# Altium schematic sheet STM32_microcontroller_IOs.SchDoc: STM32_microcontroller_IOs
size A3; Date: Not used; ApprovedBy: Not used; CheckedBy: Not used; Author: Not used; CompanyName: STMicroelectronics; DrawnBy: Not used; Engineer: Not used; Organization: Not used; Address1: Not used; Address2: Not used; Address3: Not used; Address4: Not used; DocumentNumber: Not used; Revision: Not used; SheetNumber: 3; SheetTotal: 12; CurrentTime: Not used; CurrentDate: Not used; Time: Not used; DocumentFullPathAndName: Not used; DocumentName: Not used; ModifiedDate: Not used; ImagePath: Not used; ProjectName: Not used; Application_BuildNumber: Not used
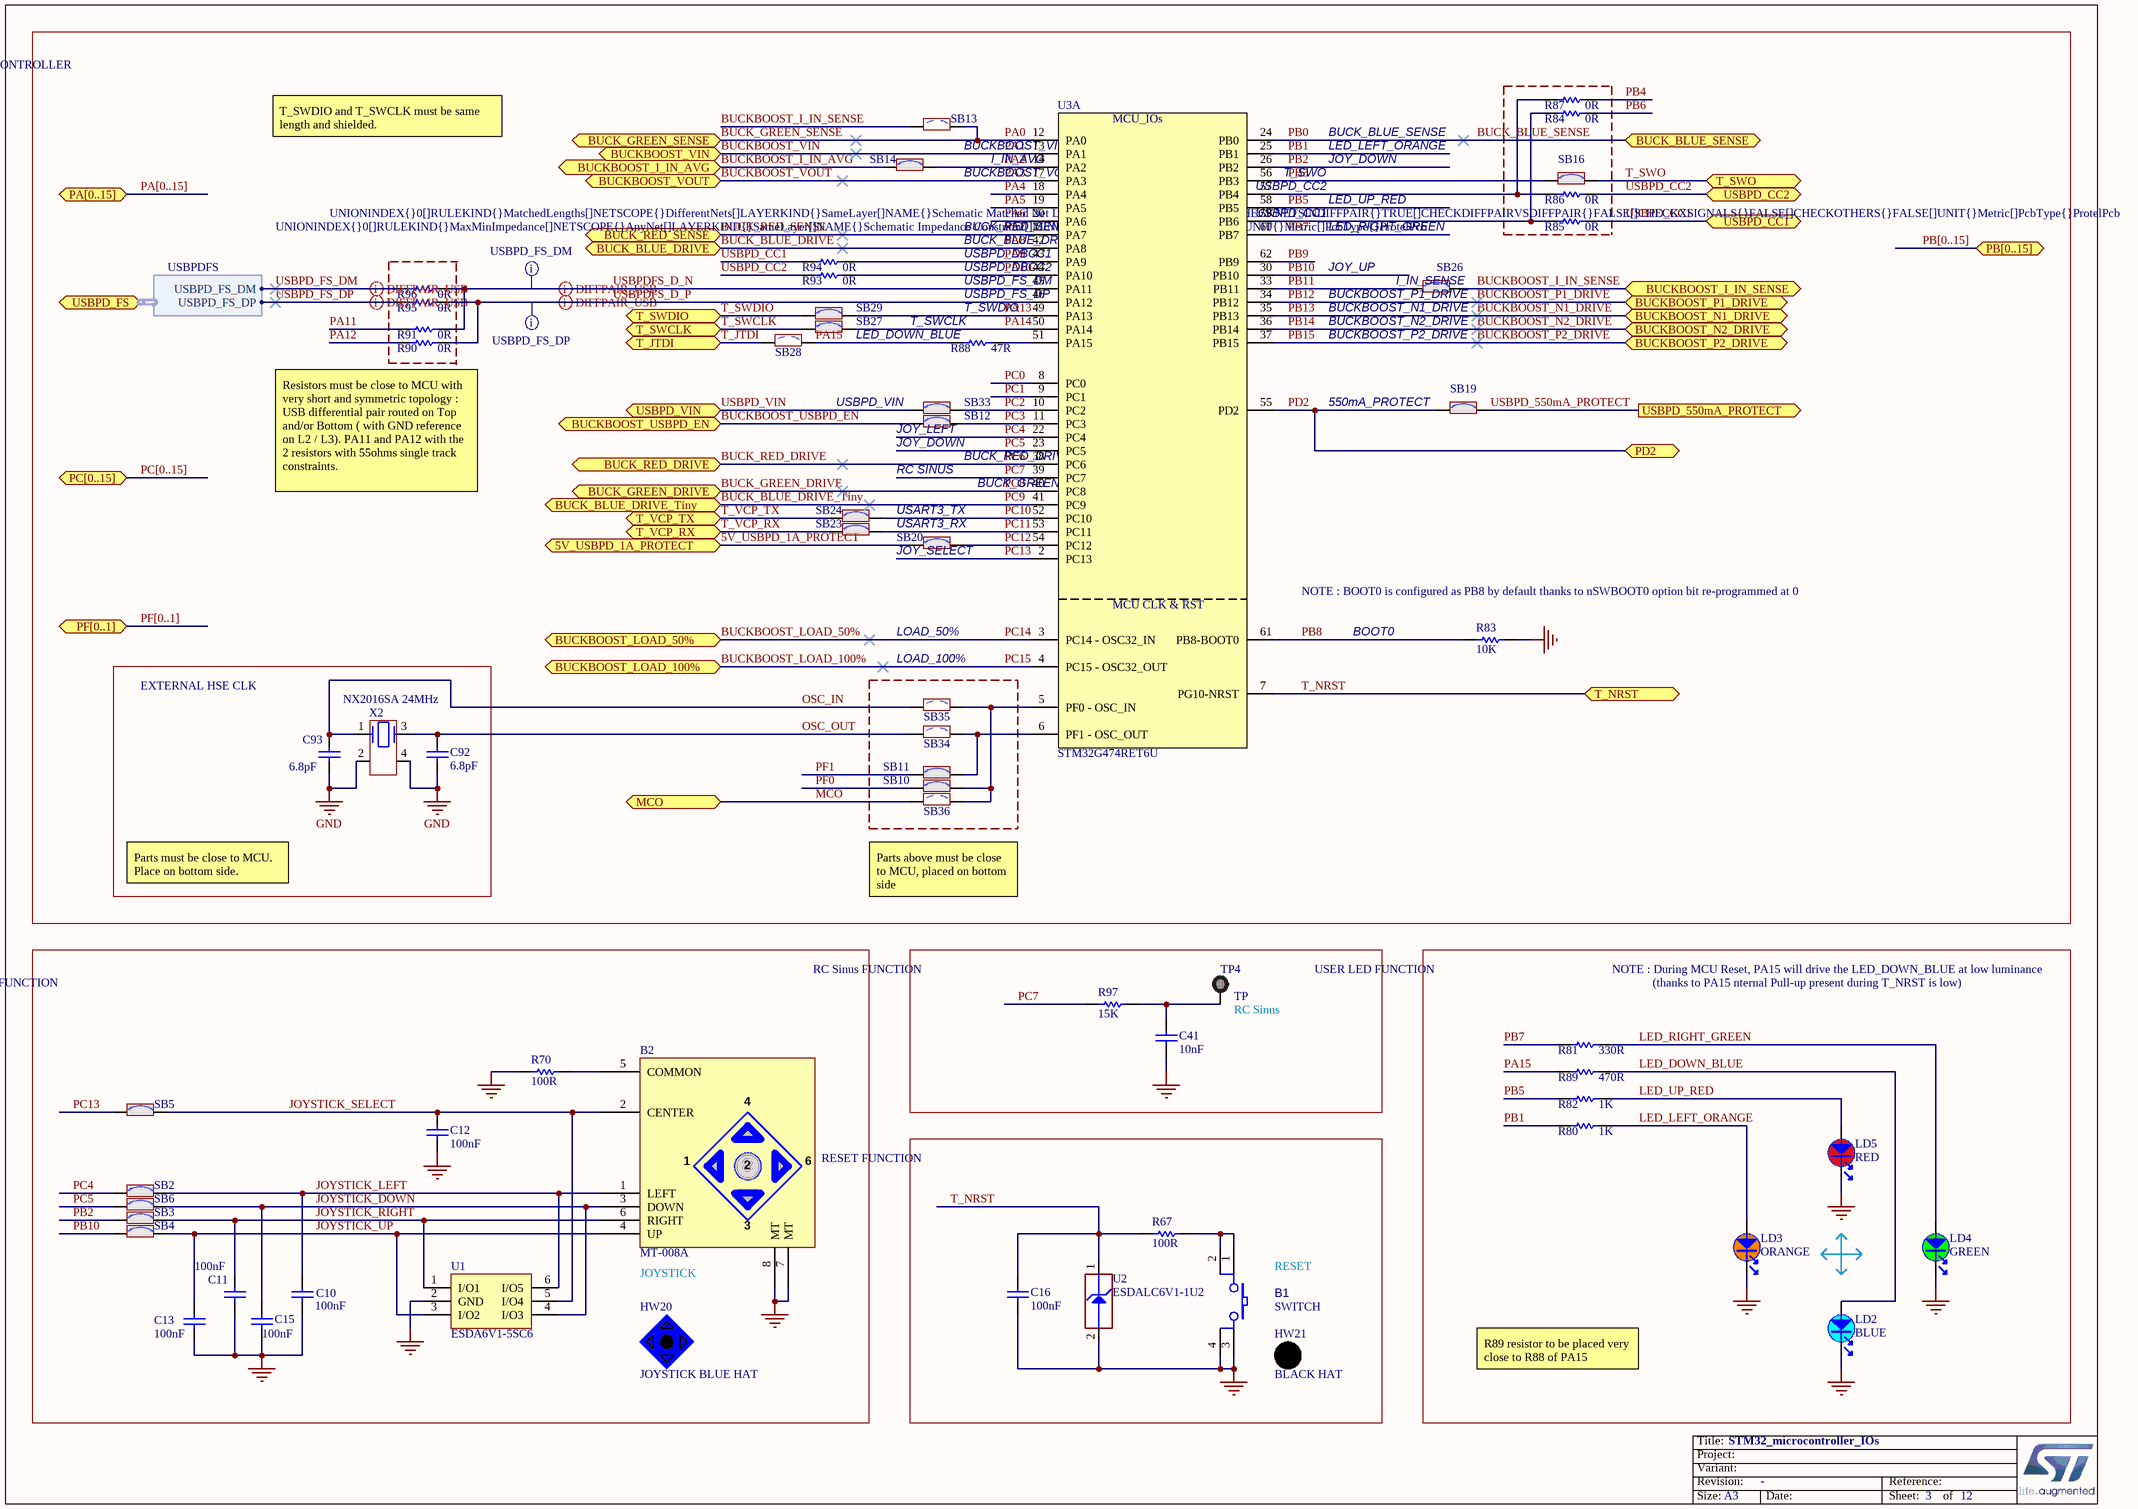
[diagram p0: STM32_microcontroller_IOs.SchDoc]

## Parts
B1  value SWITCH  [SWI_WEALTHMETAL_TD-0341_4P_BLACK]
B2  value MT-008A  [SWI_XIEJIA_MT-008A_6P]
C10  value 100nF  [C0402]
C11  value 100nF  [C0402]
C12  value 100nF  [C0402]
C13  value 100nF  [C0402]
C15  value 100nF  [C0402]
C16  value 100nF  [C0402]
C41  value 10nF  [C0603]
C92  value 6.8pF  [C0402]
C93  value 6.8pF  [C0402]
HW20  value JOYSTICK BLUE HAT  (hidden comment: JOYSTICK_BLUE_HAT)  (mechanical)
HW21  value BLACK HAT  (mechanical)
LD2  value BLUE  [LED_0603_SMD-B_BLUE_H0P4]
LD3  value ORANGE  [LED_0603_ORANGE_H0P4]
LD4  value GREEN  [LED_0603_GREEN]
LD5  value RED  [LED_0603_RED]
R67  value 100R  [R0603]
R70  value 100R  [R0603]
R80  value 1K  [R0603]
R81  value 330R  [R0603]
R82  value 1K  [R0603]
R83  value 10K  [R0603]
R84  value 0R  [R0402]
R85  value 0R  [R0402]
R86  value 0R  [R0402]
R87  value 0R  [R0402]
R88  value 47R  [R0402]
R89  value 470R  [R0603]
R90  value 0R  [R0402]
R91  value 0R  [R0402]
R93  value 0R  [R0402]
R94  value 0R  [R0402]
R95  value 0R  [R0402]
R96  value 0R  [R0402]
R97  value 15K  [R0603]
SB2  (no value)  [SOLDER-BRIDGE_R0603-0R]
SB3  (no value)  [SOLDER-BRIDGE_R0603-0R]
SB4  (no value)  [SOLDER-BRIDGE_R0603-0R]
SB5  (no value)  [SOLDER-BRIDGE_R0603-0R]
SB6  (no value)  [SOLDER-BRIDGE_R0603-0R]
SB10  (no value)  [SOLDER-BRIDGE_R0603-0R]
SB11  (no value)  [SOLDER-BRIDGE_R0603-0R]
SB12  (no value)  [SOLDER-BRIDGE_R0603-0R]
SB13  (no value)  [SOLDER-BRIDGE_R0603-0R]
SB14  (no value)  [SOLDER-BRIDGE_R0603-0R]
SB16  (no value)  [SOLDER-BRIDGE_R0603-0R]
SB19  (no value)  [SOLDER-BRIDGE_R0603-0R]
SB20  (no value)  [SOLDER-BRIDGE_R0603-0R]
SB23  (no value)  [SOLDER-BRIDGE_R0603-0R]
SB24  (no value)  [SOLDER-BRIDGE_R0603-0R]
SB26  (no value)  [SOLDER-BRIDGE_R0603-0R]
SB27  (no value)  [SOLDER-BRIDGE_R0603-0R]
SB28  (no value)  [SOLDER-BRIDGE_R0603-0R]
SB29  (no value)  [SOLDER-BRIDGE_R0603-0R]
SB33  (no value)  [SOLDER-BRIDGE_R0603-0R]
SB34  (no value)  [SOLDER-BRIDGE_R0603-0R]
SB35  (no value)  [SOLDER-BRIDGE_R0603-0R]
SB36  (no value)  [SOLDER-BRIDGE_R0603-0R]
TP4  value TP  [TP_PTH_1MM_2MM]
U1  value ESDA6V1-5SC6  [ESD_SOT23-6L]
U2  value ESDALC6V1-1U2  [ESD_ST0201]
U3  STM32G474RET6U  [ICC_LQFP64_10X10_P050]  (part A of 2)
X2  value NX2016SA 24MHz  [CRY_NX2016SA_4P]

## Blocks framed on the sheet
EXTERNAL HSE CLK: C92 C93 X2
LOAD_100%: SB10 SB11 SB34-SB36
USER LED FUNCTION: LD2-LD5 R80-R82 R89

## Ports
5V_USBPD_1A_PROTECT, BUCK_BLUE_DRIVE, BUCK_BLUE_DRIVE_Tiny, BUCK_BLUE_SENSE, BUCK_GREEN_DRIVE, BUCK_GREEN_SENSE, BUCK_RED_DRIVE, BUCK_RED_SENSE, BUCKBOOST_I_IN_AVG, BUCKBOOST_I_IN_SENSE, BUCKBOOST_LOAD_50%, BUCKBOOST_LOAD_100%, BUCKBOOST_N1_DRIVE, BUCKBOOST_N2_DRIVE, BUCKBOOST_P1_DRIVE, BUCKBOOST_P2_DRIVE, BUCKBOOST_USBPD_EN, BUCKBOOST_VIN, BUCKBOOST_VOUT, MCO, PA[0..15] (bidir), PB[0..15] (bidir), PC[0..15] (bidir), PD2, PF[0..1] (bidir), T_JTDI, T_NRST, T_SWCLK, T_SWDIO, T_SWO, T_VCP_RX, T_VCP_TX, USBPD_550mA_PROTECT, USBPD_CC1, USBPD_CC2, USBPD_FS (harness USBPDFS), USBPD_VIN

## Harnesses
USBPDFS: USBPD_FS_DM, USBPD_FS_DP

## Nets
GND: B1.3 B1.4 B2.7(MT) B2.8(MT) C10.1 C11.1 C12.1 C13.1 C15.1 C16.1 C41.1 C92.1 C93.1 LD2.2 LD3.2 LD4.2 LD5.2 R70.1 R83.1 U1.2(GND) U2.2(GND) X2.2 X2.4
5V_USBPD_1A_PROTECT: SB20.1 ; port 5V_USBPD_1A_PROTECT
BUCK_BLUE_DRIVE: U3.42(PA8) ; port BUCK_BLUE_DRIVE  [also labelled PA8]
BUCK_BLUE_DRIVE_Tiny: U3.41(PC9) ; port BUCK_BLUE_DRIVE_Tiny  [also labelled PC9]
BUCK_BLUE_SENSE: U3.24(PB0) ; port BUCK_BLUE_SENSE  [also labelled PB0]
BUCK_GREEN_DRIVE: U3.40(PC8) ; port BUCK_GREEN_DRIVE  [also labelled PC8]
BUCK_GREEN_SENSE: SB13.2 U3.12(PA0) ; port BUCK_GREEN_SENSE  [also labelled PA0]
BUCK_RED_DRIVE: U3.38(PC6) ; port BUCK_RED_DRIVE  [also labelled PC6]
BUCK_RED_SENSE: U3.21(PA7) ; port BUCK_RED_SENSE  [also labelled PA7]
BUCKBOOST_I_IN_AVG: SB14.1 ; port BUCKBOOST_I_IN_AVG
BUCKBOOST_I_IN_SENSE: SB13.1 SB26.2 ; port BUCKBOOST_I_IN_SENSE
BUCKBOOST_LOAD_50%: U3.3(PC14_-_OSC32_IN) ; port BUCKBOOST_LOAD_50%  [also labelled PC14]
BUCKBOOST_LOAD_100%: U3.4(PC15_-_OSC32_OUT) ; port BUCKBOOST_LOAD_100%  [also labelled PC15]
BUCKBOOST_N1_DRIVE: U3.35(PB13) ; port BUCKBOOST_N1_DRIVE  [also labelled PB13]
BUCKBOOST_N2_DRIVE: U3.36(PB14) ; port BUCKBOOST_N2_DRIVE  [also labelled PB14]
BUCKBOOST_P1_DRIVE: U3.34(PB12) ; port BUCKBOOST_P1_DRIVE  [also labelled PB12]
BUCKBOOST_P2_DRIVE: U3.37(PB15) ; port BUCKBOOST_P2_DRIVE  [also labelled PB15]
BUCKBOOST_USBPD_EN: SB12.1 ; port BUCKBOOST_USBPD_EN
BUCKBOOST_VIN: U3.13(PA1) ; port BUCKBOOST_VIN  [also labelled PA1]
BUCKBOOST_VOUT: U3.17(PA3) ; port BUCKBOOST_VOUT  [also labelled PA3]
JOYSTICK_DOWN: B2.3(DOWN) C15.2 SB6.2 U1.4(I/O3)
JOYSTICK_LEFT: B2.1(LEFT) C10.2 SB2.1 U1.6(I/O5)
JOYSTICK_RIGHT: B2.6(RIGHT) C11.2 SB3.1 U1.1(I/O1)
JOYSTICK_SELECT: B2.2(CENTER) C12.2 SB5.2 U1.5(I/O4)
JOYSTICK_UP: B2.4(UP) C13.2 SB4.1 U1.3(I/O2)
LED_DOWN_BLUE: LD2.1 R89.2
LED_LEFT_ORANGE: LD3.1 R80.1
LED_RIGHT_GREEN: LD4.1 R81.1
LED_UP_RED: LD5.1 R82.1
MCO: SB36.1 ; port MCO
OSC_IN: C93.2 SB35.1 X2.1
OSC_OUT: C92.2 SB34.1 X2.3
PA2: SB14.2 U3.14(PA2)
PA4: U3.18(PA4)
PA5: U3.19(PA5)
PA6: U3.20(PA6)
PA9: R94.2 U3.43(PA9)
PA10: R93.2 U3.44(PA10)
PA11: R91.1
PA12: R90.1
PA13: SB29.2 U3.49(PA13)
PA14: SB27.2 U3.50(PA14)
PA15: R88.1 R89.1 SB28.2
PB1: R80.2 U3.25(PB1)
PB2: SB3.2 U3.26(PB2)
PB3: SB16.1 U3.56(PB3)
PB4: R87.2
PB5: R82.2 U3.58(PB5)
PB6: R84.2
PB7: R81.2 U3.60(PB7)
PB8: R83.2 U3.61(PB8-BOOT0)
PB9: U3.62(PB9)
PB10: SB4.2 U3.30(PB10)
PB11: SB26.1 U3.33(PB11)
PC0: U3.8(PC0)
PC1: U3.9(PC1)
PC2: SB33.2 U3.10(PC2)
PC3: SB12.2 U3.11(PC3)
PC4: SB2.2 U3.22(PC4)
PC5: SB6.1 U3.23(PC5)
PC7: R97.1 U3.39(PC7)
PC10: SB24.2 U3.52(PC10)
PC11: SB23.2 U3.53(PC11)
PC12: SB20.2 U3.54(PC12)
PC13: SB5.1 U3.2(PC13)
PD2: SB19.1 U3.55(PD2) ; port PD2
PF0: SB10.1
PF1: SB11.1
T_JTDI: SB28.1 ; port T_JTDI
T_NRST: C16.2 R67.1 U2.1(IO1) U3.7(PG10-NRST) ; port T_NRST
T_SWCLK: SB27.1 ; port T_SWCLK
T_SWDIO: SB29.1 ; port T_SWDIO
T_SWO: SB16.2 ; port T_SWO
T_VCP_RX: SB23.1 ; port T_VCP_RX
T_VCP_TX: SB24.1 ; port T_VCP_TX
USBPD_550mA_PROTECT: SB19.2 ; port USBPD_550mA_PROTECT
USBPD_CC1: R85.2 R94.1 ; port USBPD_CC1
USBPD_CC2: R86.2 R93.1 ; port USBPD_CC2
USBPD_FS_DM: R96.1 ; port USBPD_FS.USBPD_FS_DM
USBPD_FS_DP: R95.1 ; port USBPD_FS.USBPD_FS_DP
USBPD_VIN: SB33.1 ; port USBPD_VIN
USBPDFS_D_N: R91.2 R96.2 U3.45(PA11)
USBPDFS_D_P: R90.2 R95.2 U3.46(PA12)
NetB1_1: B1.1 B1.2 R67.2
NetB2_5: B2.5(COMMON) R70.2
NetC41_2: C41.2 R97.2 TP4.1
NetR84_1: R84.1 R85.1 U3.59(PB6)
NetR86_1: R86.1 R87.1 U3.57(PB4)
NetR88_2: R88.2 U3.51(PA15)
NetSB10_2: SB10.2 SB35.2 SB36.2 U3.5(PF0_-_OSC_IN)
NetSB11_2: SB11.2 SB34.2 U3.6(PF1_-_OSC_OUT)

## Buses and harness runs
bus PA[0..15] = port PA[0..15]
bus PB[0..15] = port PB[0..15]
bus PC[0..15] = port PC[0..15]
bus PF[0..1] = port PF[0..1]

## Layout directives
differential pair; rule Impedance Constraint [Min = 85.00    Max = 95.00    ]: USBPD_FS_DM, USBPD_FS_DP, USBPDFS_D_N, USBPDFS_D_P
rule Undefined; rule Matched Net Lengths [Tolerance = 0.2mm]; rule Impedance Constraint [Min = 85.00    Max = 95.00    ]: USBPDFS_D_N, USBPDFS_D_P

## Notes on the sheet
- MICROCONTROLLER
- T_SWDIO and T_SWCLK must be same length and shielded.
- BUCKBOOST_VIN
- (near SB14) BUCKBOOST_VOUT
- I_IN_AVG
- T_SWO
- LED_LEFT_ORANGE
- JOY_DOWN
- BUCK_BLUE_SENSE
- BUCK_RED_SENSE
- BUCK_BLUE_DRIVE
- USBPD_CC2
- USBPD_CC1
- LED_UP_RED
- LED_RIGHT_GREEN
- (near R88) T_SWDIO
- USBPD_DBCC1
- USBPD_DBCC2
- USBPD_FS_DM
- USBPD_FS_DP
- JOY_UP
- (near SB26) BUCKBOOST_P1_DRIVE
- (near SB26) BUCKBOOST_N1_DRIVE
- (near SB26) I_IN_SENSE
- LED_DOWN_BLUE
- (near R88) T_SWCLK
- (near SB26) BUCKBOOST_P2_DRIVE
- (near SB26) BUCKBOOST_N2_DRIVE
- USBPD_VIN
- (near SB12) JOY_LEFT
- (near SB12) JOY_DOWN
- (near SB19) 550mA_PROTECT
- Resistors must be close to MCU with very short and symmetric topology : USB differential pair routed on Top and/or Bottom ( with GND reference on L2 / L3). PA11 and PA12 with the 2 resistors with 55ohms single track constraints.
- USART3_TX
- RC SINUS
- BUCK_RED_DRIVE
- BUCK_GREEN_DRIVE
- (near SB20) USART3_RX
- (near SB20) JOY_SELECT
- LOAD_50%
- NOTE : BOOT0 is configured as PB8 by default thanks to nSWBOOT0 option bit re-programmed at 0
- (near R83) BOOT0
- Parts must be close to MCU. Place on bottom side.
- Parts above must be close to MCU, placed on bottom side
- JOYSTICK FUNCTION
- RC Sinus FUNCTION
- NOTE : During MCU Reset, PA15 will drive the LED_DOWN_BLUE at low luminance
- (thanks to PA15 nternal Pull-up present during T_NRST is low)
- (near TP4) RC Sinus
- RESET FUNCTION
- JOYSTICK
- (near B1) RESET
- R89 resistor to be placed very close to R88 of PA15
- Title:
- Project:
- Size:
- Revision:
- Variant:
- A3
- -
- Date:
- Reference:
- Sheet:
- of
- (in symbol MCD-01584, part A) MCU_IOs; MCU CLK & RST

## Library data of the parts
B1 = MCD-00001: Non-Open Push-Button 0.1A 24V BLACK; Manufacturer_Part_Number: TD-0341; Manufacturer: WEALTHMETAL; Part_Type: Misc; Provided_By: SUBCO; Internal_Part_Number: MCD-00001; ComponentLink1Description: Datasheet; Status: Released; ComponentLink1URL: http://tunmcdsvn.tun.st.com/Component_Datasheet_Library/Trunk/Misc/Wealthmetal_Tact-Switch_TD0341
B2 = MCD-00132: Joystick, 4 dir, 1 OK; Part_Type: Misc; Manufacturer: XIEJIA Electronics; Provided_By: SUBCO; Internal_Part_Number: MCD-00132; Status: Released; Manufacturer_Part_Number: MT-008A; ComponentLink1Description: Datasheet; ComponentLink1URL: http://tunmcdsvn.tun.st.com/Component_Datasheet_Library/Trunk/Misc/Xieja electronics_MT-008A
C10-C13 C15 C16 = MCD-00102: Capacitor, MLCC, 100nF, 16V, X7R, 10%, 0402, T=0,5mm; Manufacturer_Part_Number: CC0402KRX7R7BB104; Manufacturer: YAGEO; Alternate_Manufacturer_Part_Number: GCM155R71C104KA55D; Alternate_Manufacturer: MURATA; Provided_By: SUBCO; Internal_Part_Number: MCD-00102; Status: Released; Package: C0402; ComponentLink1Description: Datasheet; Part_Type: Capacitor; ComponentLink1URL: http://tunmcdsvn.tun.st.com/Component_Datasheet_Library/Trunk/Capacitors/Yageo_Multilayer_Capacitor_X7R_series_100pF_to_22uF
C41 = MCD-01007: Capacitor, MLCC, 10nF, 16V, X7R, 10%, 0603, T=0.8mm; Manufacturer_Part_Number: CC0603KRX7R7BB103; Manufacturer: YAGEO; Provided_By: SUBCO; Internal_Part_Number: MCD-01007; Status: Released; Part_Type: Capacitor; Package: C0603; ComponentLink1Description: Datasheet; ComponentLink1URL: http://tunmcdsvn.tun.st.com/Component_Datasheet_Library/Trunk/Capacitors/Yageo_Multilayer_Capacitor_X7R_series_100pF_to_22uF/
C92 C93 = MCD-00674: Capacitor, MLCC, 6.8pF, 50V, NPO, +-0.25pF, 0402, T=0.5mm; Manufacturer_Part_Number: CC0402CRNPO9BN6R8; Manufacturer: YAGEO; Provided_By: SUBCO; Internal_Part_Number: MCD-00674; Status: Released; Part_Type: Capacitor; Package: C0402; ComponentLink1Description: Datasheet; ComponentLink1URL: http://tunmcdsvn.tun.st.com/Component_Datasheet_Library/Trunk/Capacitors/Yageo_Capacitor_NP0_16V-to-50V
HW20 = MCD-01337: Joystick Blue Hat; Part_Type: Mechanical; Manufacturer_Part_Number: PB-504; Manufacturer: JIUBABA; Provided_By: SUBCO; Internal_Part_Number: MCD-01337; Status: Checked; ComponentLink1Description: Datasheet; ComponentLink1URL: http://tunmcdsvn.tun.st.com/Component_Datasheet_Library/Trunk/Mechanical/JIUBABA_JOYSTICK_HAT_PB-504
HW21 = MCD-00635: Black Hat for switch TD0341X-G01-BLA; Part_Type: Mechanical; Manufacturer_Part_Number: 988.16.09.3.00003_SH-517; Manufacturer: JIUBABA; Provided_By: SUBCO; Internal_Part_Number: MCD-00635; Status: Released; ComponentLink1Description: Datasheet; ComponentLink1URL: http://tunmcdsvn.tun.st.com/Component_Datasheet_Library/Trunk/Mechanical/Jiubaba_HAT_SH-517
LD2 = MCD-01131: LED Blue, 0603 SMD, Forward Voltage Min=2,8V, Max=3,1V; Part_Type: Display; Manufacturer_Part_Number: 19-217-BHC-ZL1M2RY-3T; Manufacturer: EVERLIGHT; Provided_By: SUBCO; Internal_Part_Number: MCD-01131; Status: Footprint available; Package: 0603; ComponentLink1Description: Datasheet; ComponentLink1URL: http://tunmcdsvn.tun.st.com/Component_Datasheet_Library/Trunk/Display/Everlight_SMD-LED-BLUE_19-213BHC-ZK1L2B11X-3T/Everlight_SMD-LED-BLUE_19-217-BHC-ZL1M2RY-3T-V4.pdf
LD3 = MCD-00321: LED, Orange, 0603; Part_Type: Display; Manufacturer_Part_Number: 19-217/S2C-AM2N2VY/3T; Manufacturer: EVERLIGHT; Provided_By: SUBCO; Internal_Part_Number: MCD-00321; Status: Released; Package: LED 0603; ComponentLink1Description: Datasheet; ComponentLink1URL: http://tunmcdsvn.tun.st.com/Component_Datasheet_Library/Trunk/Display/Everlight_SMD-LED-Orange_19-217-S2C-AM2N2VY-3T_V1
LD4 = MCD-00050: LED, Green, 0603; Manufacturer_Part_Number: 19-213SYGC/S530-E2/TR8; Manufacturer: EVERLIGHT; Part_Type: Display; Provided_By: SUBCO; Internal_Part_Number: MCD-00050; ComponentLink1Description: Datasheet; Status: Released; ComponentLink1URL: http://tunmcdsvn.tun.st.com/Component_Datasheet_Library/Trunk/Display/Everlight_SMD-LED-GREEN_19-213SYGC-S530-XX-TR8-v3.doc; Package: LED 0603
LD5 = MCD-00049: LED, Red, 0603; Part_Type: Display; Manufacturer_Part_Number: 19-213-R6C-AP1Q2B/3T; Manufacturer: EVERLIGHT; Provided_By: SUBCO; Internal_Part_Number: MCD-00049; Status: Released; Package: LED 0603; ComponentLink1Description: Datasheet; ComponentLink1URL: http://tunmcdsvn.tun.st.com/Component_Datasheet_Library/Trunk/Display/Everlight_SMD-LED-RED_19-213-R6C-AP1Q2B-3T-V3.doc
R67 R70 = MCD-00224: Resistor,100R,0603,1%,1/10W; Manufacturer_Part_Number: RC0603FR-07100RL; Manufacturer: YAGEO; Provided_By: SUBCO; Internal_Part_Number: MCD-00224; Status: Released; Part_Type: Resistor; Package: R0603; ComponentLink1Description: Datasheet; ComponentLink1URL: http://tunmcdsvn.tun.st.com/Component_Datasheet_Library/Trunk/Resistors/Yageo_Resistor_RC0603-series
R80 R82 = MCD-00070: Resistor,1K,0603,1%,1/10W; Manufacturer_Part_Number: RC0603FR-071KL; Manufacturer: YAGEO; Provided_By: SUBCO; Internal_Part_Number: MCD-00070; Status: Released; Part_Type: Resistor; Package: R0603; ComponentLink1Description: Datasheet; ComponentLink1URL: http://tunmcdsvn.tun.st.com/Component_Datasheet_Library/Trunk/Resistors/Yageo_Resistor_RC0603-series
R81 = MCD-00197: Resistor,330R,0603,1%,1/10W; Manufacturer_Part_Number: RC0603FR-07330RL; Manufacturer: YAGEO; BMS_Part_Number: 9129729; Provided_By: SUBCO; Internal_Part_Number: MCD-00197; Status: Released; Part_Type: Resistor; Package: R0603; ComponentLink1Description: Datasheet; ComponentLink1URL: http://tunmcdsvn.tun.st.com/Component_Datasheet_Library/Trunk/Resistors/Yageo_Resistor_RC0603-series
R83 = MCD-00220: Resistor,10K,0603,1%,1/10W; Manufacturer_Part_Number: RC0603FR-0710KL; Manufacturer: YAGEO; Provided_By: SUBCO; Internal_Part_Number: MCD-00220; ComponentLink1Description: Datasheet; Status: Released; Part_Type: Resistor; Package: R0603; ComponentLink1URL: http://tunmcdsvn.tun.st.com/Component_Datasheet_Library/Trunk/Resistors/Yageo_Resistor_RC0603-series
R84-R87 R90 R91 R93-R96 = MCD-00052: Resistor,0R,0402,5%,1/16W; Manufacturer_Part_Number: RC0402JR-070RL; Manufacturer: YAGEO; Provided_By: SUBCO; Internal_Part_Number: MCD-00052; Status: Released; Part_Type: Resistor; Package: R0402; ComponentLink1Description: Datasheet; ComponentLink1URL: http://tunmcdsvn.tun.st.com/Component_Datasheet_Library/Trunk/Resistors/Yageo_Resistor_RC0402-series
R88 = MCD-00481: Resistor,47R,0402,1%,1/16W; Manufacturer_Part_Number: RC0402FR-0747RL; Manufacturer: YAGEO; Provided_By: SUBCO; Internal_Part_Number: MCD-00481; Status: Released; Part_Type: Resistor; Package: R0402; ComponentLink1Description: Datasheet; ComponentLink1URL: http://tunmcdsvn.tun.st.com/Component_Datasheet_Library/Trunk/Resistors/Yageo_Resistor_RC0402-series
R89 = MCD-00354: Resistor,470R,0603,1%,1/10W; Manufacturer_Part_Number: RC0603FR-07470RL; Manufacturer: YAGEO; BMS_Part_Number: 9129906; Provided_By: SUBCO; Internal_Part_Number: MCD-00354; Status: Released; Part_Type: Resistor; Package: R0603; ComponentLink1Description: Datasheet; ComponentLink1URL: http://tunmcdsvn.tun.st.com/Component_Datasheet_Library/Trunk/Resistors/Yageo_Resistor_RC0603-series
R97 = MCD-00341: Resistor,15K,0603,1%,1/10W; Manufacturer_Part_Number: RC0603FR-0715KL; Manufacturer: YAGEO; Provided_By: SUBCO; Internal_Part_Number: MCD-00341; Status: Released; Part_Type: Resistor; Package: R0603; ComponentLink1Description: Datasheet; ComponentLink1URL: http://tunmcdsvn.tun.st.com/Component_Datasheet_Library/Trunk/Resistors/Yageo_Resistor_RC0603-series
SB2-SB6 SB10-SB12 SB14 SB16 SB19 SB20 SB23 SB24 SB26 SB27 SB29 SB33 = MCD-00071: Solder Bridge ON; Part_Type: Mechanical; Manufacturer_Part_Number: RC0603JR-070RL; Manufacturer: YAGEO; Provided_By: SUBCO; Internal_Part_Number: MCD-00071; Status: Released; Package: SB0603; ComponentLink1Description: Datasheet; ComponentLink1URL: http://tunmcdsvn.tun.st.com/Component_Datasheet_Library/Trunk/Resistors/Yageo_Resistor_RC0603-series
SB13 SB28 SB34-SB36 = MCD-00072: Solder Bridge OFF; Part_Type: Mechanical; Manufacturer_Part_Number: RC0603JR-070RL; Manufacturer: YAGEO; Provided_By: SUBCO; Internal_Part_Number: MCD-00072; Status: Released; Package: SB0603; ComponentLink1Description: Datasheet; ComponentLink1URL: http://tunmcdsvn.tun.st.com/Component_Datasheet_Library/Trunk/Resistors/Yageo_Resistor_RC0603-series
TP4 = MCD-01506: Test Point trought hole 1mm/2mm; Part_Type: Mechanical; Internal_Part_Number: MCD-01506; Status: Released; Manufacturer_Part_Number: n/a; Manufacturer: n/a; ComponentLink1Description: Datasheet; ComponentLink1URL: n/a; Provided_By: n/a
U1 = MCD-01066: 5 unidirectional Transil diodes ESD protection; Part_Type: Diode; Manufacturer: STMICROELECTRONICS; BMS_Part_Number: 9179044; Provided_By: SUBCO with ST control; Internal_Part_Number: MCD-01066; Status: Released; Manufacturer_Part_Number: ESDA6V1-5SC6; Package: SOT23-6L; ComponentLink1Description: Datasheet; ComponentLink1URL: http://tunmcdsvn.tun.st.com/Component_Datasheet_Library/Trunk/Diodes/STM_ESD_ESDA6V1_5SC6
U2 = MCD-00170: ESD protection 6V1; Part_Type: Diode; Manufacturer: STMICROELECTRONICS; BMS_Part_Number: 9151132; Provided_By: SUBCO with ST control; Internal_Part_Number: MCD-00170; Status: Released; Manufacturer_Part_Number: ESDALC6V1-1U2; ComponentLink1Description: Datasheet; ComponentLink1URL: http://tunmcdsvn.tun.st.com/Component_Datasheet_Library/Trunk/Diodes/STM_ESD_ESDALC6V1-1U2
U3 = MCD-01584: STM32G474RET6U MCU, LQFP64 10x10, 1.6, 512KB Flash, 128KB SRAM; Part_Type: IC; Manufacturer: STMICROELECTRONICS; ECCN_US: 3A991A2; ECCN_EU: NEC; Provided_By: SUBCO with ST control; Internal_Part_Number: MCD-01584; Value: STM32G474RET6U; Status: Checked; Manufacturer_Part_Number: STM32G474RET6U; Package: LQFP64 10x10 x 1.6; ComponentLink1Description: Datasheet; ComponentLink1URL: http://tunmcdsvn.tun.st.com/Component_Datasheet_Library/Trunk/IC/STM_MCU_STM32G474RET6U/STM_MCU_STM32G474RET6U.pdf
X2 = MCD-01036: Crystal 24MHz, 6pF, +-20ppm, 80ohms max, SMD; Part_Type: Crystal_Osc; Manufacturer_Part_Number: NX2016SA 24MHz EXS00A-CS10820; Manufacturer: NDK; BMS_Part_Number: 9157045; Provided_By: SUBCO; Internal_Part_Number: MCD-01036; Status: Checked; Package: (2016) 2.0 x 1.6 x 0.45 mm; ComponentLink1Description: Datasheet; ComponentLink1URL: http://tunmcdsvn.tun.st.com/Component_Datasheet_Library/Trunk/Crystal_Osc/NDK_NX2016SA 24MHz EXS00A-CS10820 (EXS10B-27366B); Order_Code_Digikey: 644-1365